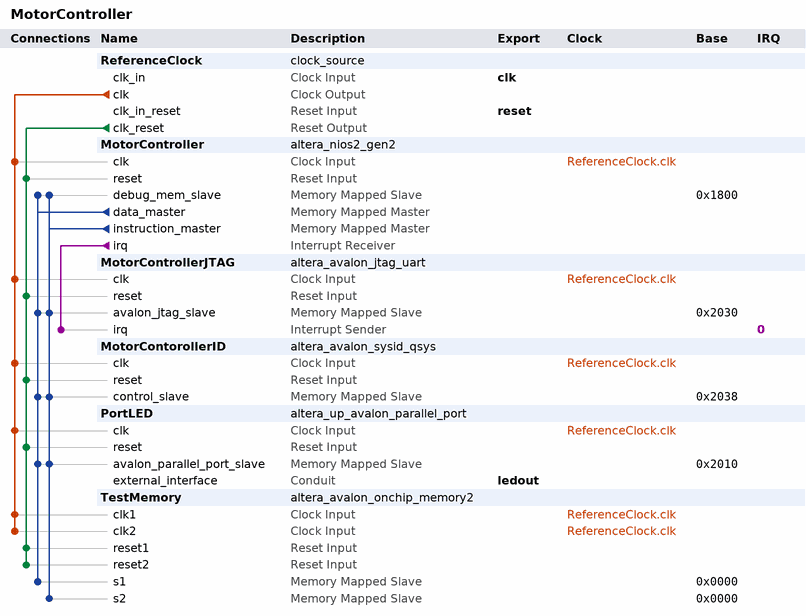
[diagram p0: system contents]
# Platform Designer (Qsys) system MotorController, Cyclone V 5CSEMA4U23C6
# Parameters at their usual value, and those the tool derives, are not listed.
package require -exact qsys 16.1
create_system MotorController
set_project_property DEVICE_FAMILY {Cyclone V}
set_project_property DEVICE 5CSEMA4U23C6

add_instance ReferenceClock clock_source 16.1
set_instance_parameter_value ReferenceClock clockFrequency 50000000

add_instance MotorController altera_nios2_gen2 16.1
set_instance_parameter_value MotorController dcache_size 2048
set_instance_parameter_value MotorController exceptionSlave TestMemory.s2
set_instance_parameter_value MotorController icache_size 4096
set_instance_parameter_value MotorController impl Tiny
set_instance_parameter_value MotorController resetSlave TestMemory.s2

add_instance MotorControllerJTAG altera_avalon_jtag_uart 16.1
set_instance_parameter_value MotorControllerJTAG simInteractiveOptions NO_INTERACTIVE_WINDOWS

add_instance MotorContorollerID altera_avalon_sysid_qsys 16.1
set_instance_parameter_value MotorContorollerID id 268435456

add_instance PortLED altera_up_avalon_parallel_port 16.1
set_instance_parameter_value PortLED board DE0-Nano
set_instance_parameter_value PortLED capture false
set_instance_parameter_value PortLED edge Rising
set_instance_parameter_value PortLED irq false
set_instance_parameter_value PortLED preset LEDs

add_instance TestMemory altera_avalon_onchip_memory2 16.1
set_instance_parameter_value TestMemory dataWidth 32
set_instance_parameter_value TestMemory dualPort true
set_instance_parameter_value TestMemory initMemContent true
set_instance_parameter_value TestMemory initializationFileName onchip_mem.hex
set_instance_parameter_value TestMemory memorySize 4096

# connections
add_connection ReferenceClock.clk MotorContorollerID.clk clock
add_connection ReferenceClock.clk MotorController.clk clock
add_connection ReferenceClock.clk MotorControllerJTAG.clk clock
add_connection ReferenceClock.clk PortLED.clk clock
add_connection ReferenceClock.clk TestMemory.clk1 clock
add_connection ReferenceClock.clk TestMemory.clk2 clock
add_connection ReferenceClock.clk_reset MotorContorollerID.reset reset
add_connection ReferenceClock.clk_reset MotorController.reset reset
add_connection ReferenceClock.clk_reset MotorControllerJTAG.reset reset
add_connection ReferenceClock.clk_reset PortLED.reset reset
add_connection ReferenceClock.clk_reset TestMemory.reset1 reset
add_connection ReferenceClock.clk_reset TestMemory.reset2 reset
add_connection MotorController.data_master MotorContorollerID.control_slave avalon
set_connection_parameter_value MotorController.data_master/MotorContorollerID.control_slave baseAddress 0x2038
add_connection MotorController.data_master MotorController.debug_mem_slave avalon
set_connection_parameter_value MotorController.data_master/MotorController.debug_mem_slave baseAddress 0x1800
add_connection MotorController.data_master MotorControllerJTAG.avalon_jtag_slave avalon
set_connection_parameter_value MotorController.data_master/MotorControllerJTAG.avalon_jtag_slave baseAddress 0x2030
add_connection MotorController.data_master PortLED.avalon_parallel_port_slave avalon
set_connection_parameter_value MotorController.data_master/PortLED.avalon_parallel_port_slave baseAddress 0x2010
add_connection MotorController.data_master TestMemory.s1 avalon
set_connection_parameter_value MotorController.data_master/TestMemory.s1 baseAddress 0x0000
add_connection MotorController.instruction_master MotorContorollerID.control_slave avalon
set_connection_parameter_value MotorController.instruction_master/MotorContorollerID.control_slave baseAddress 0x2038
add_connection MotorController.instruction_master MotorController.debug_mem_slave avalon
set_connection_parameter_value MotorController.instruction_master/MotorController.debug_mem_slave baseAddress 0x1800
add_connection MotorController.instruction_master MotorControllerJTAG.avalon_jtag_slave avalon
set_connection_parameter_value MotorController.instruction_master/MotorControllerJTAG.avalon_jtag_slave baseAddress 0x2030
add_connection MotorController.instruction_master PortLED.avalon_parallel_port_slave avalon
set_connection_parameter_value MotorController.instruction_master/PortLED.avalon_parallel_port_slave baseAddress 0x2010
add_connection MotorController.instruction_master TestMemory.s2 avalon
set_connection_parameter_value MotorController.instruction_master/TestMemory.s2 baseAddress 0x0000
add_connection MotorController.irq MotorControllerJTAG.irq interrupt
set_connection_parameter_value MotorController.irq/MotorControllerJTAG.irq irqNumber 0

# exported interfaces
add_interface clk clock sink
set_interface_property clk EXPORT_OF ReferenceClock.clk_in
add_interface ledout conduit end
set_interface_property ledout EXPORT_OF PortLED.external_interface
add_interface reset reset sink
set_interface_property reset EXPORT_OF ReferenceClock.clk_in_reset

set_interconnect_requirement {$system} qsys_mm.clockCrossingAdapter HANDSHAKE
set_interconnect_requirement {$system} qsys_mm.enableEccProtection FALSE
set_interconnect_requirement {$system} qsys_mm.insertDefaultSlave FALSE
set_interconnect_requirement {$system} qsys_mm.maxAdditionalLatency 1

save_system MotorController.qsys
